# Altium schematic sheet Relay schematic.SchDoc
size A4; Date: 24/10; Author: Rami Abdelmotalib; DocumentName: Relay circuit
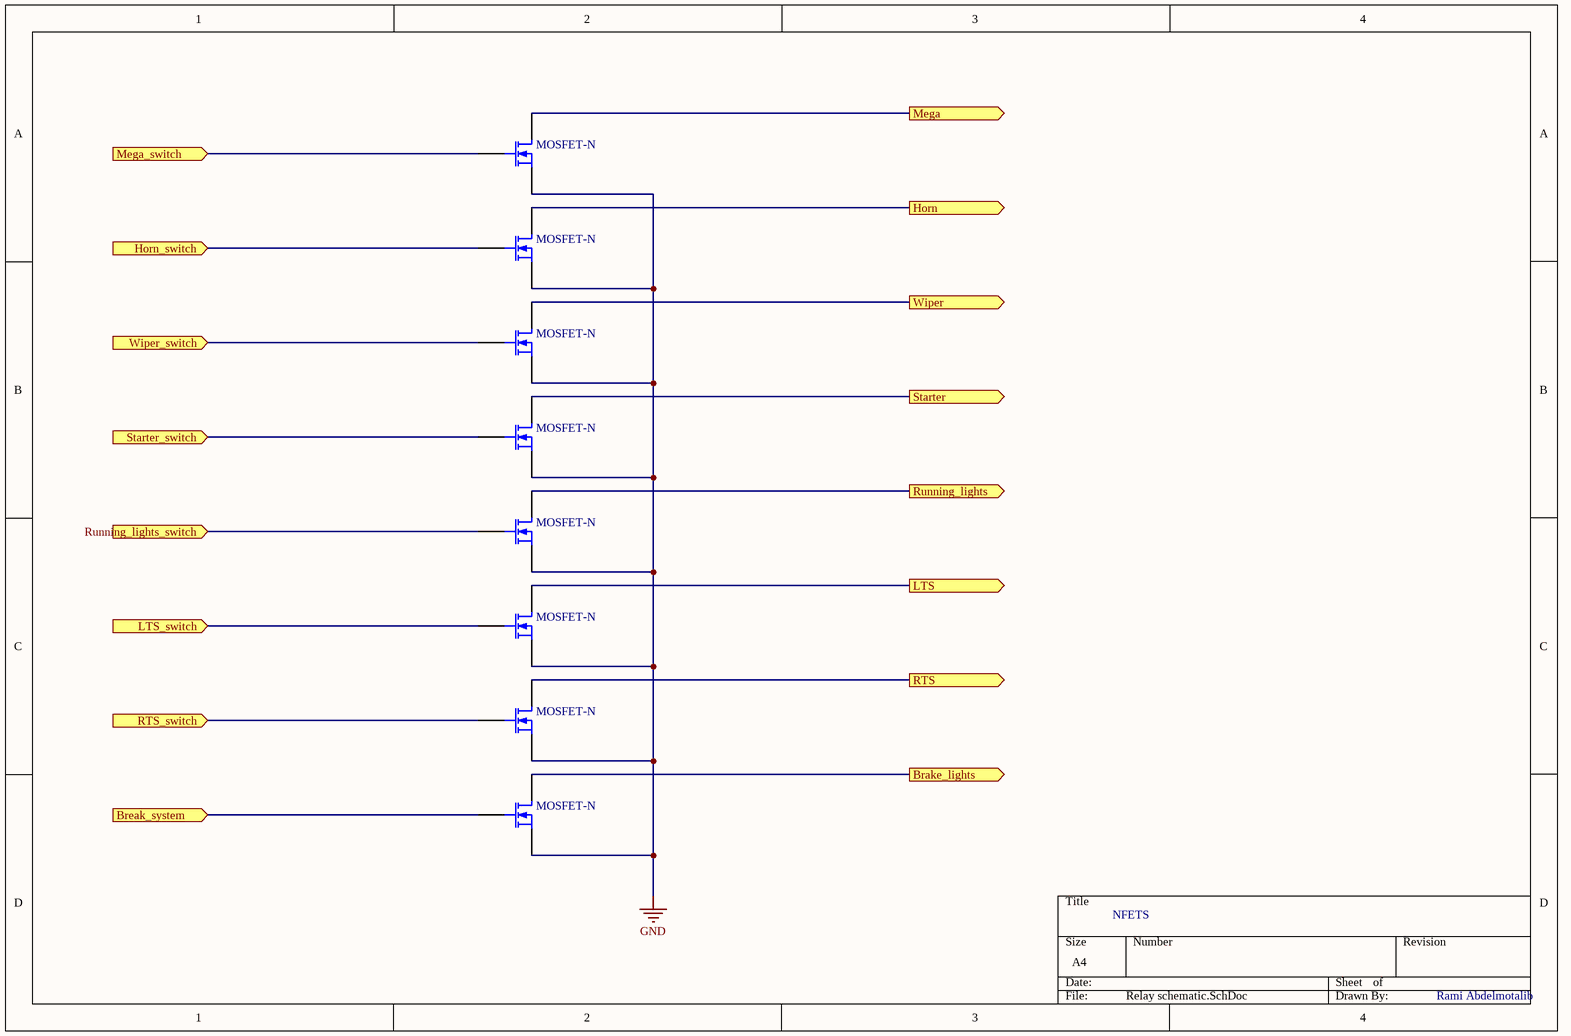
[diagram p0: Relay schematic.SchDoc]

## Parts
(Parts that share a designator on the sheet are numbered #1, #2 ... from top to bottom, then left to right.)
MOSFET-N#1  (no value)  [E3]
MOSFET-N#2  (no value)  [E3]
MOSFET-N#3  (no value)  [E3]
MOSFET-N#4  (no value)  [E3]
MOSFET-N#5  (no value)  [E3]
MOSFET-N#6  (no value)  [E3]
MOSFET-N#7  (no value)  [E3]
MOSFET-N#8  (no value)  [E3]

## Ports
Brake_lights (out), Break_system (in), Horn (out), Horn_switch (in), LTS (out), LTS_switch (in), Mega (out), Mega_switch (in), RTS (out), RTS_switch (in), Running_lights (out), Running_lights_switch (in), Starter (out), Starter_switch (in), Wiper (out), Wiper_switch (in)

## Nets
GND: MOSFET-N#1.3(S) MOSFET-N#2.3(S) MOSFET-N#3.3(S) MOSFET-N#4.3(S) MOSFET-N#5.3(S) MOSFET-N#6.3(S) MOSFET-N#7.3(S) MOSFET-N#8.3(S)
Brake_lights: MOSFET-N#8.1(D) ; port Brake_lights
Break_system: MOSFET-N#8.2(G) ; port Break_system
Horn: MOSFET-N#2.1(D) ; port Horn
Horn_switch: MOSFET-N#2.2(G) ; port Horn_switch
LTS: MOSFET-N#6.1(D) ; port LTS
LTS_switch: MOSFET-N#6.2(G) ; port LTS_switch
Mega: MOSFET-N#1.1(D) ; port Mega
Mega_switch: MOSFET-N#1.2(G) ; port Mega_switch
RTS: MOSFET-N#7.1(D) ; port RTS
RTS_switch: MOSFET-N#7.2(G) ; port RTS_switch
Running_lights: MOSFET-N#5.1(D) ; port Running_lights
Running_lights_switch: MOSFET-N#5.2(G) ; port Running_lights_switch
Starter: MOSFET-N#4.1(D) ; port Starter
Starter_switch: MOSFET-N#4.2(G) ; port Starter_switch
Wiper: MOSFET-N#3.1(D) ; port Wiper
Wiper_switch: MOSFET-N#3.2(G) ; port Wiper_switch

## Notes on the sheet
- NFETS
- Rami Abdelmotalib

## Library data of the parts
MOSFET-N#1-MOSFET-N#8 = MOSFET-N: N-Channel MOSFET; Published: 8-Jun-2000; LatestRevisionDate: 17-Jul-2002; LatestRevisionNote: Re-released for DXP Platform.; PackageVersion: 1995/1996; PackageReference: E3; Publisher: Altium Limited; PackageDescription: TO, Flat Index; 3 In-Line, Axial Leads; Body Dia. 4.6mm; Lead Dia. 0.5 mm (max)